# Altium project Elektromagnet_Driver_EUROBOT_2016.PrjPcb
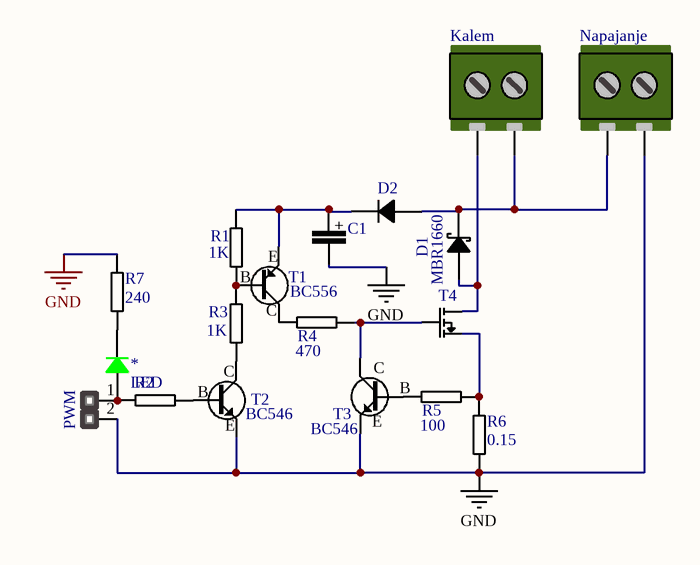
[diagram p0: Elektromagnet_Driver_EUROBOT_2016_SCH.SchDoc]
1 sheet, 18 parts. Net scope: global (net labels, ports and power ports of the same name join across sheets).
Board file: Elektromagnet_Driver_EUROBOT_2016_PCB.PcbDoc

## Sheet Elektromagnet_Driver_EUROBOT_2016_SCH.SchDoc
size A4

### Parts
C1  C2  [C2(elektrolit)]  (value not drawn)
D1  MBR1660  [D2(TO220)]
D2  D1  [D1(300milsa)]  (value not drawn)
Kalem  Klema  [Klema]  (value not drawn)
LED  LED  [LED(3mm)]
Napajanje  Klema  [Klema]  (value not drawn)
PWM  Header1x2  [Header1x2]  (value not drawn)
R1  1K  [R1(300milsa)]
R2  R1  [R1(300milsa)]  (value not drawn)
R3  1K  [R1(300milsa)]
R4  470  [R1(300milsa)]
R5  100  [R1(300milsa)]
R6  0.15  [R1(2W)]
R7  240  [R1(300milsa)]
T1  BC556  [BC327]
T2  BC546  [BC327]
T3  BC546  [BC327]
T4  FET2  [TO220]  (value not drawn)

### Nets
GND: C1.2 Napajanje.2 PWM.2 R6.1 R7.2 T2.3 T3.3
NetC1_1: C1.1 D2.2 R1.2 T1.2
NetD1_1: D1.1 Kalem.1 T4.2
NetD1_2: D1.2 D2.1 Kalem.2 Napajanje.1
NetLED_1: LED.1 PWM.1 R2.1
NetLED_2: LED.2 R7.1
NetR1_1: R1.1 R3.1 T1.1
NetR2_2: R2.2 T2.1
NetR3_2: R3.2 T2.2
NetR4_1: R4.1 T1.3
NetR4_2: R4.2 T3.2 T4.1
NetR5_1: R5.1 T3.1
NetR5_2: R5.2 R6.2 T4.3

### Notes on the sheet
- (in symbol C2) +
- (in symbol Transistor NPN) C; B; E
- (in symbol Transistor PNP) E; B; C

### Library data of the parts
D1 = Sotki Diode
R1 R3-R7 = R1
T1 = Transistor PNP
T2 T3 = Transistor NPN